# Altium schematic sheet Power.SchDoc
size A4
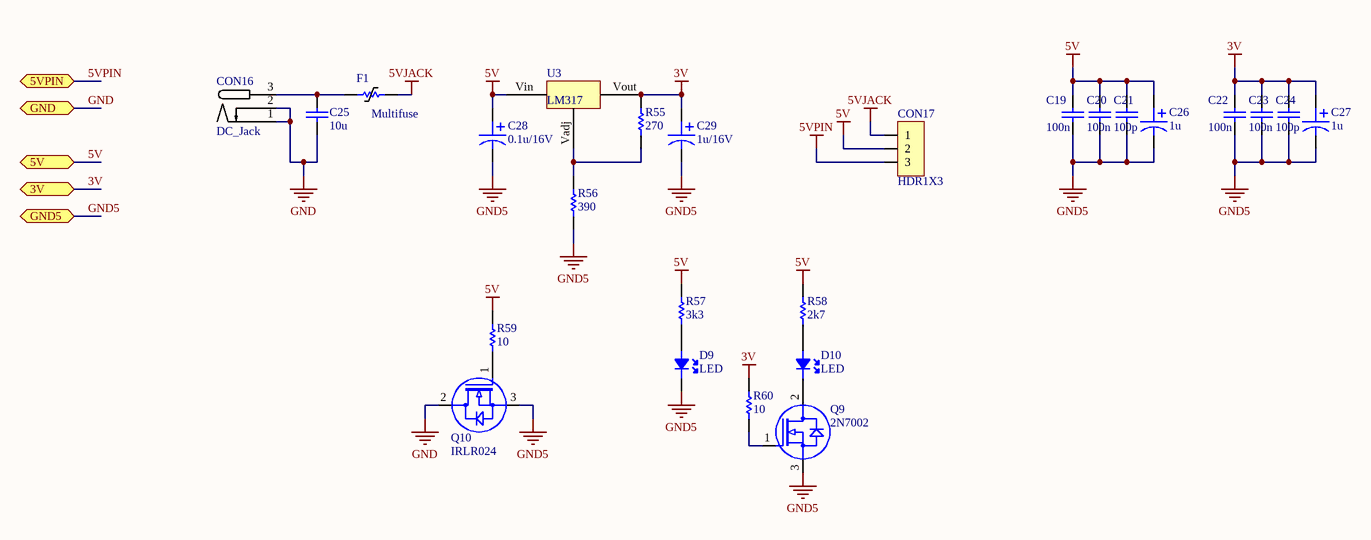
[diagram p0: Power.SchDoc]

## Parts
C19  100n  [0805C]
C20  100n  [0805C]
C21  100p  [0805C]
C22  100n  [0805C]
C23  100n  [0805C]
C24  100p  [0805C]
C25  10u  [0805C]
C26  1u  [CA]
C27  1u  [CA]
C28  0.1u/16V  [CA]
C29  1u/16V  [CA]
CON16  DC_Jack  [DC_JACK_CIRCLE]
CON17  HDR1X3  [HDR1X3RAST]
D9  LED  [0805LED]
D10  LED  [0805LED]
F1  Multifuse  [1210FUSE]
Q9  2N7002  [SOT23]
Q10  IRLR024  [TO-252AA]
R55  270  [0805R]
R56  390  [0805R]
R57  3k3  [0805R]
R58  2k7  [0805R]
R59  10  [0805R]
R60  10  [0805R]
U3  LM317  [DPAK-3]

## Ports
3V, 5V, 5VPIN, GND, GND5

## Nets
3V: C22.2 C23.2 C24.2 C27.1 C29.1 R55.2 R60.2 U3.Vout ; port 3V
5V: C19.2 C20.2 C21.2 C26.1 C28.1 CON17.2 R57.2 R58.2 R59.2 U3.Vin ; port 5V
5VJACK: CON17.1 F1.2
5VPIN: CON17.3 ; port 5VPIN
GND: C25.1 CON16.1 CON16.2 Q10.2(DRAIN) ; port GND
GND5: C19.1 C20.1 C21.1 C22.1 C23.1 C24.1 C26.2 C27.2 C28.2 C29.2 D9.2(K) Q9.3(SOURCE) Q10.3(SOURCE) R56.1 ; port GND5
NetC25_2: C25.2 CON16.3 F1.1
NetD9_1: D9.1(A) R57.1
NetD10_1: D10.1(A) R58.1
NetD10_2: D10.2(K) Q9.2(DRAIN)
NetQ9_1: Q9.1(GATE) R60.1
NetQ10_1: Q10.1(GATE) R59.1
NetR55_1: R55.1 R56.2 U3.Vadj

## Library data of the parts
C19-C25 = CAPACITOR
  C19 C20 C22 C23: Value: 100n
  C21 C24: Value: 100p
  C25: Value: 10u
C26-C29 = ELECTROLYTIC_CAPACITOR
  C26 C27: Value: 1u
  C28: Value: 0.1u/16V
  C29: Value: 1u/16V
D9 = LED: COLOR: RED
D10 = LED: COLOR: GREEN
R55-R60 = RESISTOR
  R55: Value: 270
  R56: Value: 390
  R57: Value: 3k3
  R58: Value: 2k7
  R59 R60: Value: 10
Q9 = 2N7002: FARNELL: 2306371
Q10 = IRLR024: FARNELL: 2468052RL
U3 = LM317: LOMEX: 44-02-23